# Altium schematic sheet push-button-switch.SchDoc
size A4; SheetNumber: 3; SheetTotal: 3
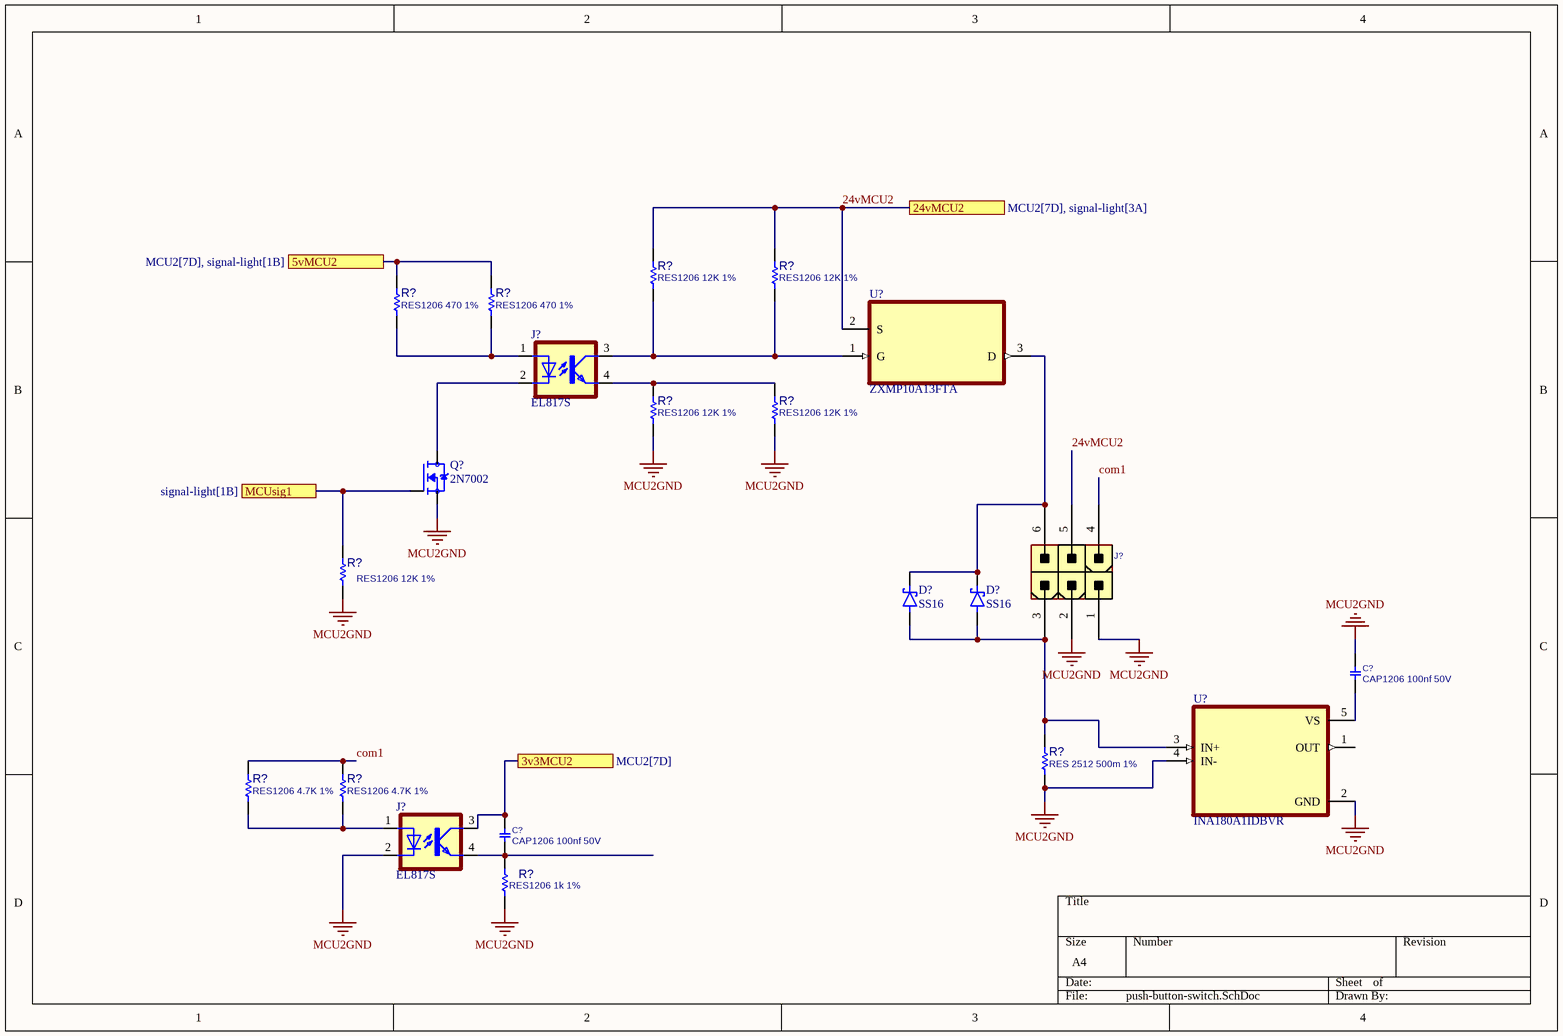
[diagram p0: push-button-switch.SchDoc]

## Parts
(Parts that share a designator on the sheet are numbered #1, #2 ... from top to bottom, then left to right.)
C?#1  CAP1206 100nf 50V  [C1206]
C?#2  CAP1206 100nf 50V  [C1206]
D?#1  SS16  [DIOM4325X250N]
D?#2  SS16  [DIOM4325X250N]
J?#1  EL817S  [SOIC254P1030X460-4N]
J?#2  CONN_ATXPWR_6  [ATXPWR_6]  (value not drawn)
J?#3  EL817S  [SOIC254P1030X460-4N]
Q?  2N7002  [SOT95P240X111-3N]
R?#1  RES1206 12K 1%  [R1206]
R?#2  RES1206 12K 1%  [R1206]
R?#3  RES1206 470 1%  [R1206]
R?#4  RES1206 470 1%  [R1206]
R?#5  RES1206 12K 1%  [R1206]
R?#6  RES1206 12K 1%  [R1206]
R?#7  RES1206 12K 1%  [R1206]
R?#8  RES 2512 500m 1%  [R2512]
R?#9  RES1206 4.7K 1%  [R1206]
R?#10  RES1206 4.7K 1%  [R1206]
R?#11  RES1206 1k 1%  [R1206]
U?#1  ZXMP10A13FTA  [SOT95P230X110-3N]
U?#2  INA180A1IDBVR  [SOT95P280X145-5N]

## Ports
3v3MCU2 (see MCU2[7D]), 5vMCU2 (see MCU2[7D], signal-light[1B]), 24vMCU2 (see MCU2[7D], signal-light[3A]), MCUsig1 (see signal-light[1B])

## Nets
MCU2GND: C?#1.1 J?#2.1 J?#2.2 J?#3.2(C) Q?.2(S) R?#5.2 R?#6.2 R?#7.2 R?#8.1 R?#11.1 U?#2.2(GND) U?#2.4(IN-)
3v3MCU2: C?#2.1 J?#3.3(COL) ; port 3v3MCU2
5vMCU2: R?#3.2 R?#4.2 ; port 5vMCU2
24vMCU2: J?#2.5 R?#1.1 R?#2.1 U?#1.2(S) ; port 24vMCU2
com1: J?#2.4 R?#9.2 R?#10.2
MCUsig1: Q?.1(G) R?#7.1 ; port MCUsig1
NetC?#1_2: C?#1.2 U?#2.5(VS)
NetC?#2_2: C?#2.2 J?#3.4(EMIT) R?#11.2
NetD?#1_A: D?#1.A D?#2.A J?#2.3 R?#8.2 U?#2.3(IN+)
NetD?#1_C: D?#1.C(K) D?#2.C(K) J?#2.6 U?#1.3(D)
NetJ?#1_1: J?#1.1(A) R?#3.1 R?#4.1
NetJ?#1_2: J?#1.2(C) Q?.3(D)
NetJ?#1_3: J?#1.3(COL) R?#1.2 R?#2.2 U?#1.1(G)
NetJ?#1_4: J?#1.4(EMIT) R?#5.1 R?#6.1
NetJ?#3_1: J?#3.1(A) R?#9.1 R?#10.1

Not connected (* = marked no-connect by the designer): U?#2 1(OUT)

## Library data of the parts
C?#1 C?#2 = CAP_SMD_MLCC_1206: CAP, MLCC; PARAM: -, -%; MANF_P#: MANF_PART#; PARAM2: -V; PRICE: 100= 1$; MANF: -; ASSEMBLY: ASSEMBLY
D?#1 D?#2 = SS14: 1A, 40V, Schottky Rectifier; MF: Taiwan Semiconductor; SnapEDA_Link: https://www.snapeda.com/parts/SS14/taiwan/view-part/?ref=snap; Package: SMA-2 Taiwan Semiconductor; Value: *; MP: SS14; Check_prices: https://www.snapeda.com/parts/SS14/taiwan/view-part/?ref=eda
J?#1 J?#3 = EL817S: Optoisolator Transistor Output 5000Vrms 1 Channel 4-SMD; MF: Everlight Electronics; SnapEDA_Link: https://www.snapeda.com/parts/EL817S/Everlight+Electronics+Co+Ltd/view-part/?ref=snap; Package: SMD-4 Everlight Electronics Co Ltd; Value: *; MP: EL817S; Check_prices: https://www.snapeda.com/parts/EL817S/Everlight+Electronics+Co+Ltd/view-part/?ref=eda
J?#2 = CONN_ATXPWR_6: CONN, ATX POWER, 6 P; MANF: TE; MANF_P#: 4-1775099-1; VALUE: CONN_ATXPWR_6; MountType: THD; PACKAGE: ATXPWR-6pin; Part Type: Conn.
Q? = 2N7002: N-Channel 60V 280mA (Ta) 350mW (Ta) Surface Mount SOT-23-3 (TO-236); MF: {'manufacturer': u'onsemi'}; Package: None; Price: None; Value: *; MP: 2N7002; Availability: Unavailable
R?#1-R?#7 R?#9-R?#11 = RES_SMD_1206: RESISTOR, SMD; PARAM: 1%, 0.25W; DESC: DESCRIPTION; DIST#: MOUSER; MANF_P#: -; MANF: -; ASSEMBLY: ASSEMBLY; PRICE: -; PARAM2: -
R?#8 = RES_SMD_2512: RESISTOR, SMD; PARAM: 1%, 1W; DESC: DESCRIPTION; DIST#: MOUSER; MANF_P#: -; MANF: -; ASSEMBLY: ASSEMBLY; PRICE: -; PARAM2: -; VALUE: RES 2512 500m 1%
U?#1 = ZXMP10A13FTA: P-Channel 100 V 600mA (Ta) 625mW (Ta) Surface Mount SOT-23-3; MF: Diodes Inc.; Purchase-URL: https://pricing.snapeda.com/search/part/ZXMP10A13FTA/?ref=eda; Package: SOT-23-3 Diodes Inc.; SnapEDA_Link: https://www.snapeda.com/parts/ZXMP10A13FTA/Diodes+Inc./view-part/?ref=snap; Availability: In Stock; Value: *; MP: ZXMP10A13FTA; Check_prices: https://www.snapeda.com/parts/ZXMP10A13FTA/Diodes+Inc./view-part/?ref=eda; Price: None
U?#2 = INA180A1IDBVR: 26V, 350kHz current sense amplifier; MF: Texas Instruments; SnapEDA_Link: https://www.snapeda.com/parts/INA180A1IDBVR/Texas+Instruments/view-part/?ref=snap; Package: SOT-23-5 Texas Instruments; Value: *; MP: INA180A1IDBVR; Check_prices: https://www.snapeda.com/parts/INA180A1IDBVR/Texas+Instruments/view-part/?ref=eda